# Altium schematic sheet P05_Processor Page 3 of 3.SchDoc
size 513 x 386 mm
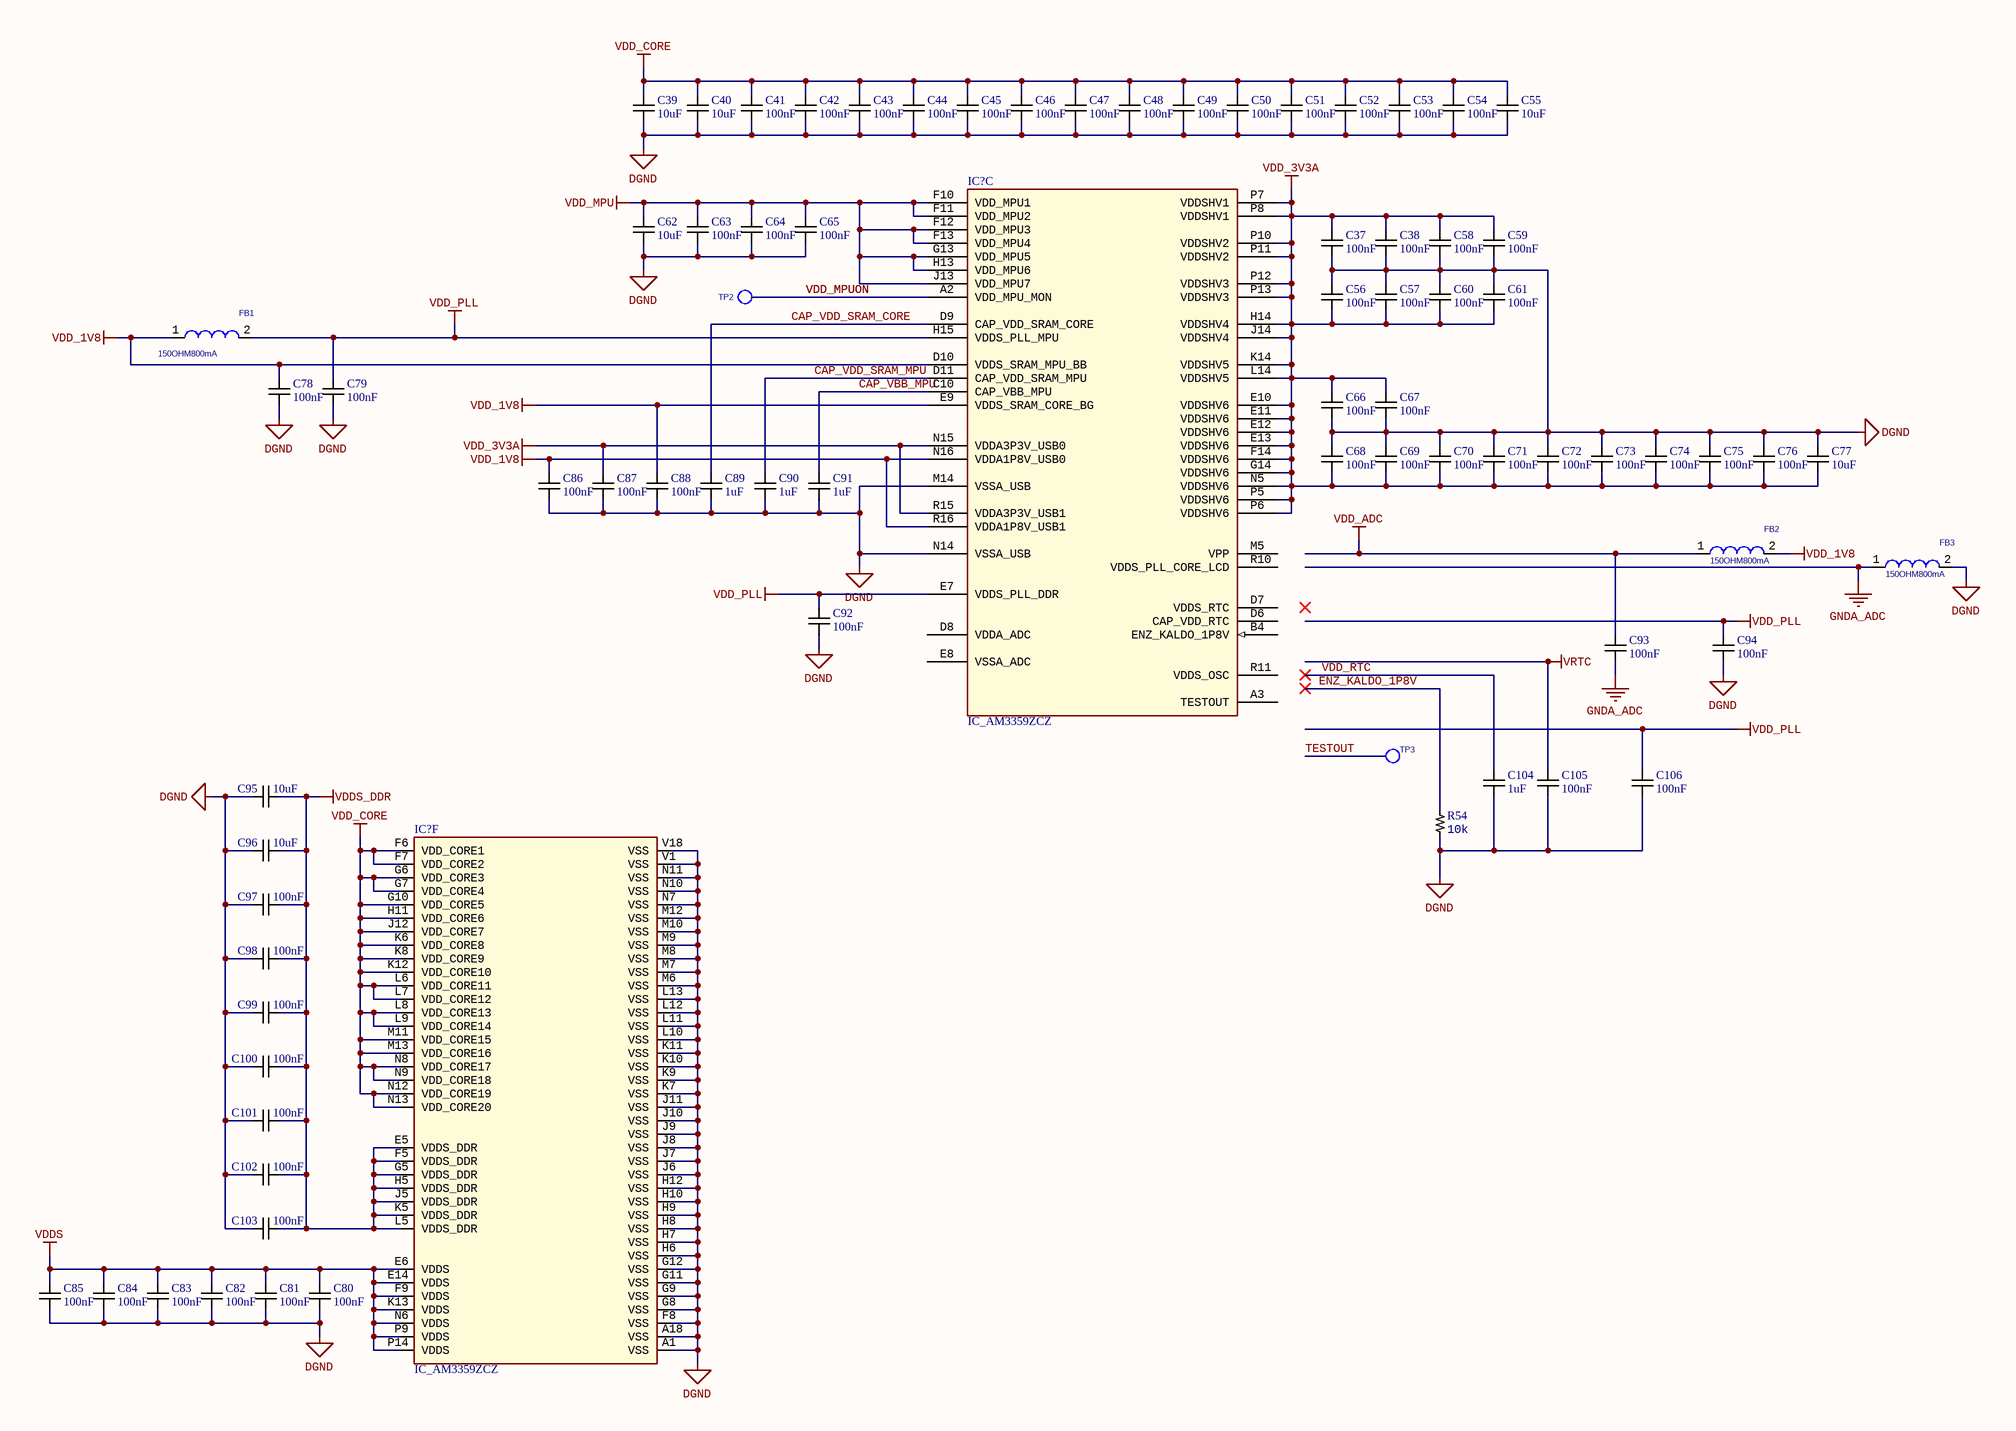
[diagram p0: P05_Processor Page 3 of 3.SchDoc]

## Parts
(Parts that share a designator on the sheet are numbered #1, #2 ... from top to bottom, then left to right.)
C37  Capacitance: 100nF  [CAP0402]  (hidden comment: C0402C104K4RACTU)
C38  Capacitance: 100nF  [CAP0402]  (hidden comment: C0402C104K4RACTU)
C39  Capacitance: 10uF  [CAP0805]  (hidden comment: C2012X6S1A106K085AC)
C40  Capacitance: 10uF  [CAP0805]  (hidden comment: C2012X6S1A106K085AC)
C41  Capacitance: 100nF  [CAP0402]  (hidden comment: C0402C104K4RACTU)
C42  Capacitance: 100nF  [CAP0402]  (hidden comment: C0402C104K4RACTU)
C43  Capacitance: 100nF  [CAP0402]  (hidden comment: C0402C104K4RACTU)
C44  Capacitance: 100nF  [CAP0402]  (hidden comment: C0402C104K4RACTU)
C45  Capacitance: 100nF  [CAP0402]  (hidden comment: C0402C104K4RACTU)
C46  Capacitance: 100nF  [CAP0402]  (hidden comment: C0402C104K4RACTU)
C47  Capacitance: 100nF  [CAP0402]  (hidden comment: C0402C104K4RACTU)
C48  Capacitance: 100nF  [CAP0402]  (hidden comment: C0402C104K4RACTU)
C49  Capacitance: 100nF  [CAP0402]  (hidden comment: C0402C104K4RACTU)
C50  Capacitance: 100nF  [CAP0402]  (hidden comment: C0402C104K4RACTU)
C51  Capacitance: 100nF  [CAP0402]  (hidden comment: C0402C104K4RACTU)
C52  Capacitance: 100nF  [CAP0402]  (hidden comment: C0402C104K4RACTU)
C53  Capacitance: 100nF  [CAP0402]  (hidden comment: C0402C104K4RACTU)
C54  Capacitance: 100nF  [CAP0402]  (hidden comment: C0402C104K4RACTU)
C55  Capacitance: 10uF  [CAP0805]  (hidden comment: C2012X6S1A106K085AC)
C56  Capacitance: 100nF  [CAP0402]  (hidden comment: C0402C104K4RACTU)
C57  Capacitance: 100nF  [CAP0402]  (hidden comment: C0402C104K4RACTU)
C58  Capacitance: 100nF  [CAP0402]  (hidden comment: C0402C104K4RACTU)
C59  Capacitance: 100nF  [CAP0402]  (hidden comment: C0402C104K4RACTU)
C60  Capacitance: 100nF  [CAP0402]  (hidden comment: C0402C104K4RACTU)
C61  Capacitance: 100nF  [CAP0402]  (hidden comment: C0402C104K4RACTU)
C62  Capacitance: 10uF  [CAP0805]  (hidden comment: C2012X6S1A106K085AC)
C63  Capacitance: 100nF  [CAP0402]  (hidden comment: C0402C104K4RACTU)
C64  Capacitance: 100nF  [CAP0402]  (hidden comment: C0402C104K4RACTU)
C65  Capacitance: 100nF  [CAP0402]  (hidden comment: C0402C104K4RACTU)
C66  Capacitance: 100nF  [CAP0402]  (hidden comment: C0402C104K4RACTU)
C67  Capacitance: 100nF  [CAP0402]  (hidden comment: C0402C104K4RACTU)
C68  Capacitance: 100nF  [CAP0402]  (hidden comment: C0402C104K4RACTU)
C69  Capacitance: 100nF  [CAP0402]  (hidden comment: C0402C104K4RACTU)
C70  Capacitance: 100nF  [CAP0402]  (hidden comment: C0402C104K4RACTU)
C71  Capacitance: 100nF  [CAP0402]  (hidden comment: C0402C104K4RACTU)
C72  Capacitance: 100nF  [CAP0402]  (hidden comment: C0402C104K4RACTU)
C73  Capacitance: 100nF  [CAP0402]  (hidden comment: C0402C104K4RACTU)
C74  Capacitance: 100nF  [CAP0402]  (hidden comment: C0402C104K4RACTU)
C75  Capacitance: 100nF  [CAP0402]  (hidden comment: C0402C104K4RACTU)
C76  Capacitance: 100nF  [CAP0402]  (hidden comment: C0402C104K4RACTU)
C77  Capacitance: 10uF  [CAP0805]  (hidden comment: C2012X6S1A106K085AC)
C78  Capacitance: 100nF  [CAP0402]  (hidden comment: C0402C104K4RACTU)
C79  Capacitance: 100nF  [CAP0402]  (hidden comment: C0402C104K4RACTU)
C80  Capacitance: 100nF  [CAP0402]  (hidden comment: C0402C104K4RACTU)
C81  Capacitance: 100nF  [CAP0402]  (hidden comment: C0402C104K4RACTU)
C82  Capacitance: 100nF  [CAP0402]  (hidden comment: C0402C104K4RACTU)
C83  Capacitance: 100nF  [CAP0402]  (hidden comment: C0402C104K4RACTU)
C84  Capacitance: 100nF  [CAP0402]  (hidden comment: C0402C104K4RACTU)
C85  Capacitance: 100nF  [CAP0402]  (hidden comment: C0402C104K4RACTU)
C86  Capacitance: 100nF  [CAP0402]  (hidden comment: C0402C104K4RACTU)
C87  Capacitance: 100nF  [CAP0402]  (hidden comment: C0402C104K4RACTU)
C88  Capacitance: 100nF  [CAP0402]  (hidden comment: C0402C104K4RACTU)
C89  Capacitance: 1uF  [CAP0402]  (hidden comment: CC0402KRX5R6BB105)
C90  Capacitance: 1uF  [CAP0402]  (hidden comment: CC0402KRX5R6BB105)
C91  Capacitance: 1uF  [CAP0402]  (hidden comment: CC0402KRX5R6BB105)
C92  Capacitance: 100nF  [CAP0402]  (hidden comment: C0402C104K4RACTU)
C93  Capacitance: 100nF  [CAP0402]  (hidden comment: C0402C104K4RACTU)
C94  Capacitance: 100nF  [CAP0402]  (hidden comment: C0402C104K4RACTU)
C95  Capacitance: 10uF  [CAP0805]  (hidden comment: C2012X6S1A106K085AC)
C96  Capacitance: 10uF  [CAP0805]  (hidden comment: C2012X6S1A106K085AC)
C97  Capacitance: 100nF  [CAP0402]  (hidden comment: C0402C104K4RACTU)
C98  Capacitance: 100nF  [CAP0402]  (hidden comment: C0402C104K4RACTU)
C99  Capacitance: 100nF  [CAP0402]  (hidden comment: C0402C104K4RACTU)
C100  Capacitance: 100nF  [CAP0402]  (hidden comment: C0402C104K4RACTU)
C101  Capacitance: 100nF  [CAP0402]  (hidden comment: C0402C104K4RACTU)
C102  Capacitance: 100nF  [CAP0402]  (hidden comment: C0402C104K4RACTU)
C103  Capacitance: 100nF  [CAP0402]  (hidden comment: C0402C104K4RACTU)
C104  Capacitance: 1uF  [CAP0402]  (hidden comment: CC0402KRX5R6BB105)
C105  Capacitance: 100nF  [CAP0402]  (hidden comment: C0402C104K4RACTU)
C106  Capacitance: 100nF  [CAP0402]  (hidden comment: C0402C104K4RACTU)
FB1  150OHM800mA  [FB0805]
FB2  150OHM800mA  [FB0805]
FB3  150OHM800mA  [FB0805]
IC?#1  IC_AM3359ZCZ  [BGA-324]  (part C of 6)
IC?#2  IC_AM3359ZCZ  [BGA-324]  (part F of 6)
R54  Resistance: 10k  [RES0402]  (hidden comment: RC0402FR-0710KL)
TP2  TESTPT1  [tp1-8040]  (value not drawn)  (no BOM)
TP3  TESTPT1  [tp1-8040]  (value not drawn)  (no BOM)

## Nets
DGND: C37.2 C38.2 C39.1 C40.1 C41.2 C42.2 C43.2 C44.2 C45.2 C46.2 C47.2 C48.2 C49.2 C50.2 C51.2 C52.2 C53.2 C54.2 C55.1 C56.1 C57.1 C58.2 C59.2 C60.1 C61.1 C62.1 C63.2 C64.2 C65.2 C66.2 C67.2 C68.1 C69.1 C70.1 C71.1 C72.1 C73.1 C74.1 C75.1 C76.1 C77.2 C78.2 C79.2 C80.2 C81.2 C82.2 C83.2 C84.2 C85.2 C86.2 C87.2 C88.2 C89.2 C90.2 C91.2 C92.2 C94.2 C95.1 C96.1 C97.2 C98.2 C99.2 C100.2 C101.2 C102.2 C103.2 C104.2 C105.2 C106.2 FB3.2 IC?#1.M14(VSSA_USB) IC?#1.N14(VSSA_USB) IC?#2.A1(VSS) IC?#2.A18(VSS) IC?#2.F8(VSS) IC?#2.G8(VSS) IC?#2.G9(VSS) IC?#2.G11(VSS) IC?#2.G12(VSS) IC?#2.H6(VSS) IC?#2.H7(VSS) IC?#2.H8(VSS) IC?#2.H9(VSS) IC?#2.H10(VSS) IC?#2.H12(VSS) IC?#2.J6(VSS) IC?#2.J7(VSS) IC?#2.J8(VSS) IC?#2.J9(VSS) IC?#2.J10(VSS) IC?#2.J11(VSS) IC?#2.K7(VSS) IC?#2.K9(VSS) IC?#2.K10(VSS) IC?#2.K11(VSS) IC?#2.L10(VSS) IC?#2.L11(VSS) IC?#2.L12(VSS) IC?#2.L13(VSS) IC?#2.M6(VSS) IC?#2.M7(VSS) IC?#2.M8(VSS) IC?#2.M9(VSS) IC?#2.M10(VSS) IC?#2.M12(VSS) IC?#2.N7(VSS) IC?#2.N10(VSS) IC?#2.N11(VSS) IC?#2.V1(VSS) IC?#2.V18(VSS) R54.2
GNDA_ADC: C93.2 FB3.1
VDD_1V8: C78.1 C86.1 C88.1 FB1.1 FB2.2 IC?#1.D10(VDDS_SRAM_MPU_BB) IC?#1.E9(VDDS_SRAM_CORE_BG) IC?#1.N16(VDDA1P8V_USB0) IC?#1.R16(VDDA1P8V_USB1)
VDD_3V3A: C37.1 C38.1 C56.2 C57.2 C58.1 C59.1 C60.2 C61.2 C66.1 C67.1 C68.2 C69.2 C70.2 C71.2 C72.2 C73.2 C74.2 C75.2 C76.2 C77.1 C87.1 IC?#1.E10(VDDSHV6) IC?#1.E11(VDDSHV6) IC?#1.E12(VDDSHV6) IC?#1.E13(VDDSHV6) IC?#1.F14(VDDSHV6) IC?#1.G14(VDDSHV6) IC?#1.H14(VDDSHV4) IC?#1.J14(VDDSHV4) IC?#1.K14(VDDSHV5) IC?#1.L14(VDDSHV5) IC?#1.N5(VDDSHV6) IC?#1.N15(VDDA3P3V_USB0) IC?#1.P5(VDDSHV6) IC?#1.P6(VDDSHV6) IC?#1.P7(VDDSHV1) IC?#1.P8(VDDSHV1) IC?#1.P10(VDDSHV2) IC?#1.P11(VDDSHV2) IC?#1.P12(VDDSHV3) IC?#1.P13(VDDSHV3) IC?#1.R15(VDDA3P3V_USB1)
VDD_ADC: C93.1 FB2.1
VDD_CORE: C39.2 C40.2 C41.1 C42.1 C43.1 C44.1 C45.1 C46.1 C47.1 C48.1 C49.1 C50.1 C51.1 C52.1 C53.1 C54.1 C55.2 IC?#2.F6(VDD_CORE1) IC?#2.F7(VDD_CORE2) IC?#2.G6(VDD_CORE3) IC?#2.G7(VDD_CORE4) IC?#2.G10(VDD_CORE5) IC?#2.H11(VDD_CORE6) IC?#2.J12(VDD_CORE7) IC?#2.K6(VDD_CORE8) IC?#2.K8(VDD_CORE9) IC?#2.K12(VDD_CORE10) IC?#2.L6(VDD_CORE11) IC?#2.L7(VDD_CORE12) IC?#2.L8(VDD_CORE13) IC?#2.L9(VDD_CORE14) IC?#2.M11(VDD_CORE15) IC?#2.M13(VDD_CORE16) IC?#2.N8(VDD_CORE17) IC?#2.N9(VDD_CORE18) IC?#2.N12(VDD_CORE19) IC?#2.N13(VDD_CORE20)
VDD_MPU: C62.2 C63.1 C64.1 C65.1 IC?#1.F10(VDD_MPU1) IC?#1.F11(VDD_MPU2) IC?#1.F12(VDD_MPU3) IC?#1.F13(VDD_MPU4) IC?#1.G13(VDD_MPU5) IC?#1.H13(VDD_MPU6) IC?#1.J13(VDD_MPU7)
VDD_PLL: C79.1 C92.1 C94.1 C106.1 FB1.2 IC?#1.E7(VDDS_PLL_DDR) IC?#1.H15(VDDS_PLL_MPU)
VDDS: C80.1 C81.1 C82.1 C83.1 C84.1 C85.1 IC?#2.E6(VDDS) IC?#2.E14(VDDS) IC?#2.F9(VDDS) IC?#2.K13(VDDS) IC?#2.N6(VDDS) IC?#2.P9(VDDS) IC?#2.P14(VDDS)
VDDS_DDR: C95.2 C96.2 C97.1 C98.1 C99.1 C100.1 C101.1 C102.1 C103.1 IC?#2.E5(VDDS_DDR) IC?#2.F5(VDDS_DDR) IC?#2.G5(VDDS_DDR) IC?#2.H5(VDDS_DDR) IC?#2.J5(VDDS_DDR) IC?#2.K5(VDDS_DDR) IC?#2.L5(VDDS_DDR)
VRTC: C105.1
CAP_VBB_MPU: C91.1 IC?#1.C10(CAP_VBB_MPU)
CAP_VDD_SRAM_CORE: C89.1 IC?#1.D9(CAP_VDD_SRAM_CORE)
CAP_VDD_SRAM_MPU: C90.1 IC?#1.D11(CAP_VDD_SRAM_MPU)
ENZ_KALDO_1P8V: R54.1
TESTOUT: TP3.1(TP)
VDD_MPUON: IC?#1.A2(VDD_MPU_MON) TP2.1(TP)
VDD_RTC: C104.1

Not connected (* = marked no-connect by the designer): IC?#1 A3(TESTOUT) B4(ENZ_KALDO_1P8V) D6(CAP_VDD_RTC) D7(VDDS_RTC) D8(VDDA_ADC) E8(VSSA_ADC) M5(VPP) R10(VDDS_PLL_CORE_LCD) R11(VDDS_OSC)

## Library data of the parts
C37 C38 C41-C54 C56-C61 C63-C76 C78-C88 C92-C94 C97-C103 C105 C106 = CAP_100nF: MLCC 100nF 0402 SMD; Manufacturer: KEMET; Tolerance: 10%; Voltage Rating (DC): 16V; Dielectric: X7R; Dissipation Factor: 3.5%; Supplier 1: Digi-Key; Supplier Part Number 1: 399-3521-1-ND; Manufacturer Part Number: C0402C104K4RACTU; RoHS: Yes; Stock 1: 6512243; Pricing 1: 1=0.10000, 10=0.04200, 100=0.01860, 500=0.01328, 1000=0.01044, 2500=0.00949, 5000=0.00873 (USD); Packaging: Tape and Reel; Mount: Surface Mount; Case/Package: 0402; Case Code (Imperial): 0402; Case Code (Metric): 1005; Contact Plating: Tin,Matte; Min Operating Temperature: -55°C; Max Operating Temperature: 125°C; Package Quantity: 10000; Voltage Rating: 16V; Termination: SMD/SMT; Length: 1mm; Height: 0.5mm; Width: 0.5mm; Depth: 0.5mm; Radiation Hardening: No; ComponentLink2URL: https://datasheet.ciiva.com/18192/getdatasheetpartid-385384-18192412.pdf?src-supplier=Verical; ComponentLink2Description: Datasheet
C39 C40 C55 C62 C77 C95 C96 = CAP_10uF: MLCC 10uF 0805 SMD; Manufacturer: TDK; Tolerance: 10%; Dielectric Material: Ceramic; Voltage Rating: 10V; Dielectric: X6S; Supplier 1: Digi-Key; Supplier Part Number 1: 445-7613-1-ND; Manufacturer Part Number: C2012X6S1A106K085AC; RoHS: Yes; Stock 1: 46852; Pricing 1: 1=0.30000, 10=0.20500, 100=0.11610, 500=0.08198, 1000=0.07173 (USD); Packaging: Tape and Reel; Mount: Surface Mount; Case/Package: 0805; Weight: 0.000194oz; Case Code (Metric): 2012; Case Code (Imperial): 0805; Min Operating Temperature: -55°C; Max Operating Temperature: 105°C; Termination: SMD/SMT; Package Quantity: 4000; Voltage Rating (DC): 10V; Composition: Ceramic; Length: 2mm; Height: 1.25mm; Depth: 1.25mm; Width: 0.049inch; Thickness: 0.037inch; REACH SVHC: No SVHC; Lead Free: Lead Free; ComponentLink3URL: https://datasheet.ciiva.com/6290/tdkmlcccaprange-6290501.pdf?src-supplier=Digi-Key; ComponentLink3Description: Datasheet
C89-C91 C104 = CAP_1uF: MLCC 1uF 0402 SMD; Manufacturer: Yageo; Tolerance: 10%; Dielectric: X5R; Voltage Rating: 10V; Dissipation Factor: 15%; Supplier 1: Digi-Key; Manufacturer Part Number: CC0402KRX5R6BB105; RoHS: Yes; Stock 1: 6411796; Pricing 1: 1=0.10000, 10=0.06300, 100=0.02790, 500=0.01996, 1000=0.01568, 2500=0.01425, 5000=0.01311 (USD); Packaging: Tape and Reel; ComponentLink1URL: https://datasheet.ciiva.com/176/upy-gphc-x5r-4v-to-50v-12-176704.pdf?src-supplier=Digi-Key; ComponentLink1Description: https://datasheet.ciiva.com/176/upy-gphc-x5r-4v-to-50v-12-176704.pdf?src-supplier=Digi-Key; Mount: Surface Mount; Case/Package: 0402; Number of Pins: 2; Case Code (Metric): 1005; Case Code (Imperial): 0402; Min Operating Temperature: -55°C; Max Operating Temperature: 85°C; Package Quantity: 1; Voltage Rating (DC): 10V; Termination: SMD/SMT; Composition: Ceramic; Length: 1mm; Height: 0.5mm; Width: 0.02inch; Thickness: 0.022inch; Depth: 0.5mm; Radiation Hardening: No; REACH SVHC: No SVHC; Lead Free: Lead Free; Halogen Free: Halogen Free; ComponentLink2URL: https://datasheet.ciiva.com/176/mlccorderingcode-176706.pdf?src-supplier=Digi-Key; ComponentLink2Description: https://datasheet.ciiva.com/176/mlccorderingcode-176706.pdf?src-supplier=Digi-Key; ComponentLink3URL: https://datasheet.ciiva.com/176/mlccorderingcode-176705.pdf?src-supplier=Digi-Key; ComponentLink3Description: https://datasheet.ciiva.com/176/mlccorderingcode-176705.pdf?src-supplier=Digi-Key
FB1-FB3 = FERR: FERRITE 800MA 150 OHM 0805 SMD; PartName: FerriteBead150ohm800mA; Mfr: Steward; MfrNum: LI0805H151R-10; TIIntPartnumber: 1L0010; Manufacturer: Laird-Signal Integrity Products; Vendor: Digikey; Impedance @ Frequency: 150 Ohm @ 100MHz; DC Resistance (DCR): 150 mOhm Max; Filter Type: Differential Mode - Single; Supplier 1: Digi-Key; Supplier Part Number 1: 240-2384-6-ND; Manufacturer Part Number: LI0805H151R-10; RoHS: RoHS Compliant; Category: Filters; Stock 1: 3694; Pricing 1: 1=0.1, 10=0.07, 25=0.064, 50=0.0574, 100=0.0421, 250=0.03064, 500=0.02808, 1000=0.02424 (USD); Current Rating: 800mA; Package / Case: 0805 (2012 Metric); Mounting Type: Surface Mount; Packaging: Digi-Reel®; Height (Max): 0.043" (1.10mm); Size / Dimension: 0.079" L x 0.049" W (2.00mm x 1.25mm); ComponentLink1URL: http://www.lairdtech.com/WorkArea/linkit.aspx?LinkIdentifier=id&ItemID=4912; ComponentLink1Description: http://www.lairdtech.com/WorkArea/linkit.aspx?LinkIdentifier=id&ItemID=4912
IC?#1 IC?#2 = IC_AM335X_ZCE_1: SubArctic Cortex A8 Processor 18x18; Manufacturer: Texas Instruments; Manufacturer Part Number: XAM3359ZCZ; Processor Type: ARM Microprocessor; Voltage: 1.06 V ~ 1.15 V; Supplier 1: Digi-Key; Supplier Part Number 1: 296-35073-ND; RoHS: RoHS Compliant; Category: Integrated Circuits (ICs); Stock 1: 16; Pricing 1: 1=33.5, 10=30.988, 100=26.465, 250=24.28752, 500=23.115, 1000=21.775, 2500=21.105, 5000=20.6025, 10000=20.1 (USD); Features: -; Speed: -; Mounting Type: Surface Mount; Package / Case: 324-LFBGA; Supplier Device Package: 324-NFBGA(15x15); Packaging: Tray; ComponentLink1URL: http://www.ti.com/lit/ds/symlink/am3354.pdf; ComponentLink1Description: http://www.ti.com/lit/ds/symlink/am3354.pdf
R54 = RES_10k: Resistor 10kOhm 0402 SMD; Manufacturer: Yageo; Temperature Coefficient: 100ppm/°C; Tolerance: 1%; Voltage Rating (DC): 50V; Power Rating: 62.5mW; Supplier 1: Digi-Key; Manufacturer Part Number: RC0402FR-0710KL; RoHS: Yes; Stock 1: 72891652; Pricing 1: 1=0.10000, 10=0.01500, 100=0.00600, 1000=0.00270, 2500=0.00235, 5000=0.00194 (USD); Composition: Thick Film; Height: 0.32mm; Number of Terminations: 2; Packaging: Tape and Reel; ComponentLink1URL: https://datasheet.ciiva.com/7660/38568-7660787.pdf?src-supplier=Element14; ComponentLink1Description: https://datasheet.ciiva.com/7660/38568-7660787.pdf?src-supplier=Element14; Case/Package: 0402; Number of Pins: 2; Case Code (Imperial): 0402; Case Code (Metric): 1005; Min Operating Temperature: -55°C; Max Operating Temperature: 155°C; Voltage Rating: 50V; Termination: SMD/SMT; Military Standard: Not; Working Voltage: 50V; Length: 1mm; Width: 0.5mm; Depth: 0.5mm; Lead Pitch: 0.2mm; REACH SVHC: No SVHC; Lead Free: Lead Free; ComponentLink2URL: https://datasheet.ciiva.com/7983/1018594-7983486.pdf?src-supplier=Element14; ComponentLink2Description: https://datasheet.ciiva.com/7983/1018594-7983486.pdf?src-supplier=Element14; ComponentLink3URL: https://datasheet.ciiva.com/7849/1784430-7849813.pdf?src-supplier=Element14; ComponentLink3Description: https://datasheet.ciiva.com/7849/1784430-7849813.pdf?src-supplier=Element14; ComponentLink4URL: https://datasheet.ciiva.com/7849/1686128-7849814.pdf?src-supplier=Element14; ComponentLink4Description: https://datasheet.ciiva.com/7849/1686128-7849814.pdf?src-supplier=Element14; ComponentLink5URL: https://datasheet.ciiva.com/7849/1784430-7849815.pdf?src-supplier=Element14; ComponentLink5Description: https://datasheet.ciiva.com/7849/1784430-7849815.pdf?src-supplier=Element14; ComponentLink6URL: https://datasheet.ciiva.com/22747/1018594-22747512.pdf?src-supplier=Element14; ComponentLink6Description: https://datasheet.ciiva.com/22747/1018594-22747512.pdf?src-supplier=Element14; ComponentLink7URL: https://datasheet.ciiva.com/12667/pyu-rc0402-51-rohs-l-6-r-12667067.pdf?src-supplier=Mouser; ComponentLink7Description: https://datasheet.ciiva.com/12667/pyu-rc0402-51-rohs-l-6-r-12667067.pdf?src-supplier=Mouser